# EAGLE design OpenSalinity_v02 (EAGLE 7.5.0)
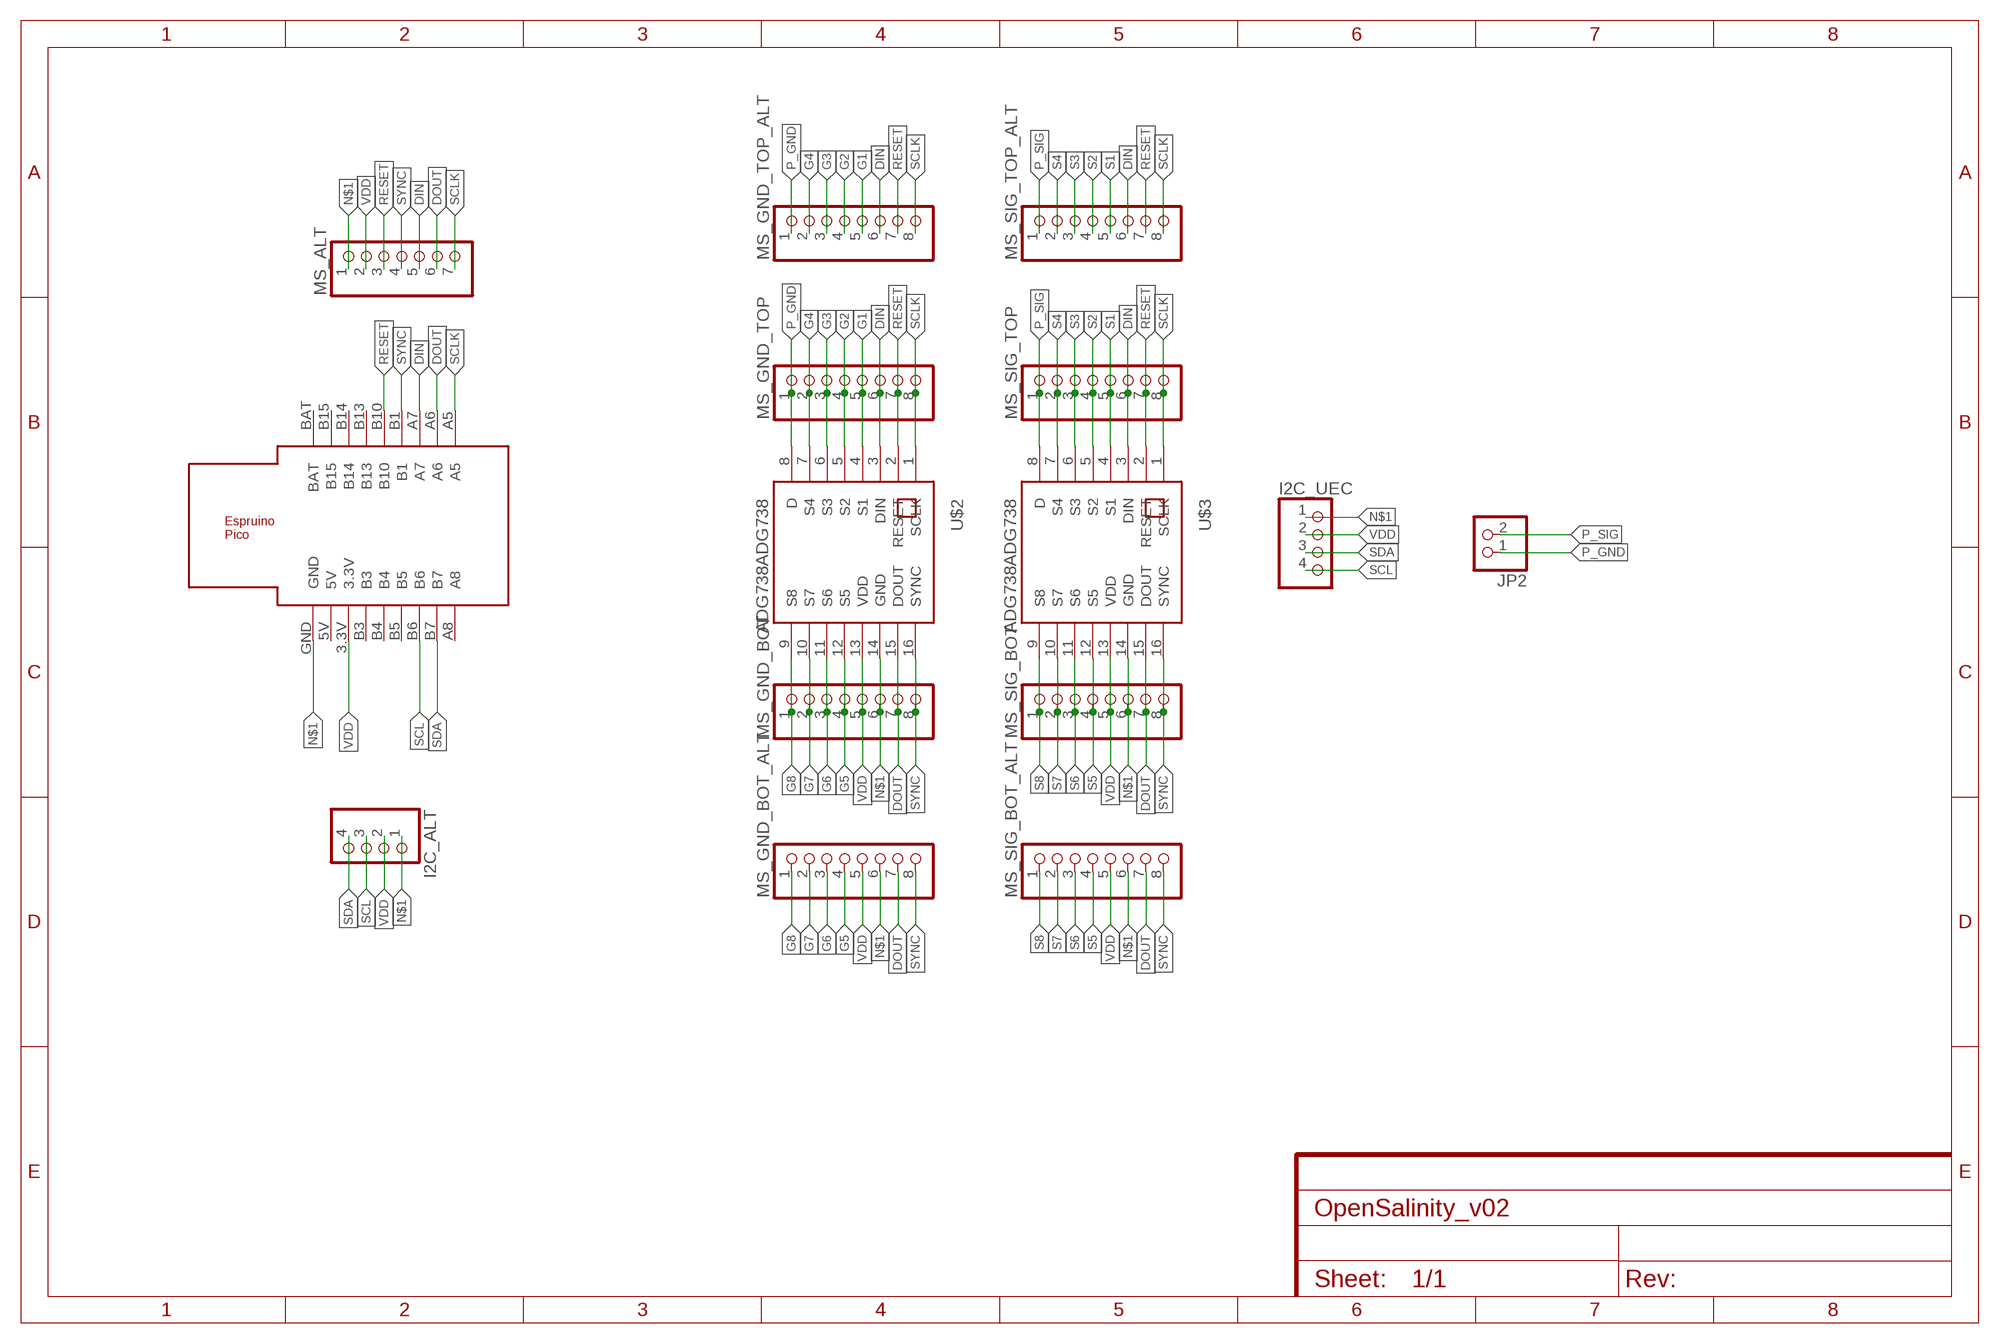
[diagram p0: schematic, sheet 1]
FRAME1 (FRAME-A4L): CNAME: CC BY SA 4.0; CREVISION: 1; DESIGNER: Sebastian Plamauer

## Parts
I2C_ALT  PINHD-1X4  [1X04]
I2C_UEC  PINHD-1X4  [1X04]
JP2  PINHD-1X2  [1X02]
MS_ALT  PINHD-1X7  [1X07]
MS_GND_BOT  PINHD-1X8  [1X08]
MS_GND_BOT_ALT  PINHD-1X8  [1X08]
MS_GND_TOP  PINHD-1X8  [1X08]
MS_GND_TOP_ALT  PINHD-1X8  [1X08]
MS_SIG_BOT  PINHD-1X8  [1X08]
MS_SIG_BOT_ALT  PINHD-1X8  [1X08]
MS_SIG_TOP  PINHD-1X8  [1X08]
MS_SIG_TOP_ALT  PINHD-1X8  [1X08]
U$1  ESPRUINO_PICO_0.1  [ESPRUINO_PICO_0.1]
U$2  ADG738ADG738  [TSSOP16]
U$3  ADG738ADG738  [TSSOP16]

## Nets
DIN: MS_ALT.5 MS_GND_TOP.6 MS_GND_TOP_ALT.6 MS_SIG_TOP.6 MS_SIG_TOP_ALT.6 U$1.A7 U$2.3(DIN) U$3.3(DIN)
DOUT: MS_ALT.6 MS_GND_BOT.7 MS_GND_BOT_ALT.7 MS_SIG_BOT.7 MS_SIG_BOT_ALT.7 U$1.A6 U$2.15(DOUT) U$3.15(DOUT)
G1: MS_GND_TOP.5 MS_GND_TOP_ALT.5 U$2.4(S1)
G2: MS_GND_TOP.4 MS_GND_TOP_ALT.4 U$2.5(S2)
G3: MS_GND_TOP.3 MS_GND_TOP_ALT.3 U$2.6(S3)
G4: MS_GND_TOP.2 MS_GND_TOP_ALT.2 U$2.7(S4)
G5: MS_GND_BOT.4 MS_GND_BOT_ALT.4 U$2.12(S5)
G6: MS_GND_BOT.3 MS_GND_BOT_ALT.3 U$2.11(S6)
G7: MS_GND_BOT.2 MS_GND_BOT_ALT.2 U$2.10(S7)
G8: MS_GND_BOT.1 MS_GND_BOT_ALT.1 U$2.9(S8)
N$1: I2C_ALT.1 I2C_UEC.1 MS_ALT.1 MS_GND_BOT.6 MS_GND_BOT_ALT.6 MS_SIG_BOT.6 MS_SIG_BOT_ALT.6 U$1.GND U$2.14(GND) U$3.14(GND)
P_GND: JP2.1 MS_GND_TOP.1 MS_GND_TOP_ALT.1 U$2.8(D)
P_SIG: JP2.2 MS_SIG_TOP.1 MS_SIG_TOP_ALT.1 U$3.8(D)
RESET: MS_ALT.3 MS_GND_TOP.7 MS_GND_TOP_ALT.7 MS_SIG_TOP.7 MS_SIG_TOP_ALT.7 U$1.B10 U$2.2(RESET) U$3.2(RESET)
S1: MS_SIG_TOP.5 MS_SIG_TOP_ALT.5 U$3.4(S1)
S2: MS_SIG_TOP.4 MS_SIG_TOP_ALT.4 U$3.5(S2)
S3: MS_SIG_TOP.3 MS_SIG_TOP_ALT.3 U$3.6(S3)
S4: MS_SIG_TOP.2 MS_SIG_TOP_ALT.2 U$3.7(S4)
S5: MS_SIG_BOT.4 MS_SIG_BOT_ALT.4 U$3.12(S5)
S6: MS_SIG_BOT.3 MS_SIG_BOT_ALT.3 U$3.11(S6)
S7: MS_SIG_BOT.2 MS_SIG_BOT_ALT.2 U$3.10(S7)
S8: MS_SIG_BOT.1 MS_SIG_BOT_ALT.1 U$3.9(S8)
SCL: I2C_ALT.3 I2C_UEC.4 U$1.B6
SCLK: MS_ALT.7 MS_GND_TOP.8 MS_GND_TOP_ALT.8 MS_SIG_TOP.8 MS_SIG_TOP_ALT.8 U$1.A5 U$2.1(SCLK) U$3.1(SCLK)
SDA: I2C_ALT.4 I2C_UEC.3 U$1.B7
SYNC: MS_ALT.4 MS_GND_BOT.8 MS_GND_BOT_ALT.8 MS_SIG_BOT.8 MS_SIG_BOT_ALT.8 U$1.B1 U$2.16(SYNC) U$3.16(SYNC)
VDD: I2C_ALT.2 I2C_UEC.2 MS_ALT.2 MS_GND_BOT.5 MS_GND_BOT_ALT.5 MS_SIG_BOT.5 MS_SIG_BOT_ALT.5 U$1.3.3V U$2.13(VDD) U$3.13(VDD)
Unconnected: U$1.5V U$1.A8 U$1.B3 U$1.B4 U$1.B5 U$1.B13 U$1.B14 U$1.B15 U$1.BAT

## Library data of the parts
I2C_ALT I2C_UEC = pinhead:PINHD-1X4: PIN HEADER
JP2 = pinhead:PINHD-1X2: PIN HEADER
MS_ALT = pinhead:PINHD-1X7: PIN HEADER
MS_GND_BOT MS_GND_BOT_ALT MS_GND_TOP MS_GND_TOP_ALT MS_SIG_BOT MS_SIG_BOT_ALT MS_SIG_TOP MS_SIG_TOP_ALT = pinhead:PINHD-1X8: PIN HEADER
U$1 = espruino_pico:ESPRUINO_PICO_0.1
U$2 U$3 = ADG738:ADG738

## Board
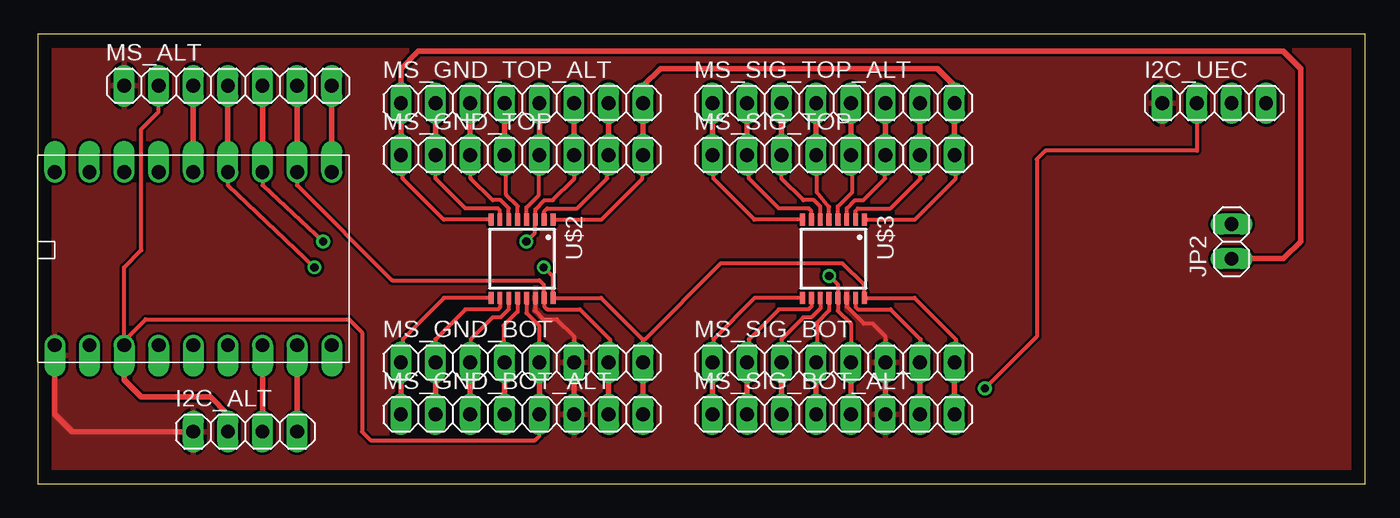
[diagram p1: board, top side]
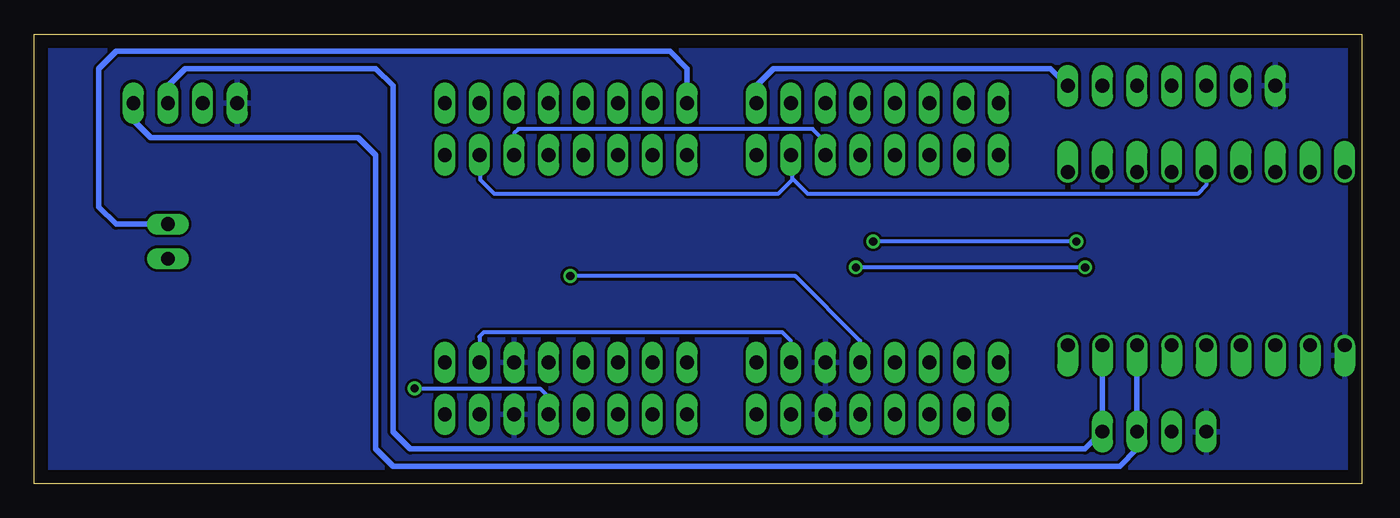
[diagram p2: board, bottom side, seen from below]

Size 97.46 x 33.01 mm. Coordinates in mm from the lower left corner, seen from the top.
Outline: 0,0 97.46,0 97.46,33.01 0,33.01 0,0
Copper layers (1*16): Top 0.035mm / dielectric 1.5mm / Bottom 0.035mm
Design rules "default": minimum track width 10mil, minimum drill 24mil, track to track 8mil, track to pad 8mil, pad to pad 8mil, via to via 8mil, smd to smd 8mil, copper to edge 40mil, drill to drill 8mil, minimum pad ring 10mil, minimum via ring 8mil, stop-mask expansion 4mil, vias tented up to drill 0mil, thermal gap 10mil

### Footprints (pad centres in the part's own frame; a part is rotated, then mirrored left to right if it is on the bottom)
1X04 = drill 1.016 long: 1 -3.81,0; 2 -1.27,0; 3 1.27,0; 4 3.81,0
1X02 = drill 1.016 long: 1 -1.27,0; 2 1.27,0
1X07 = drill 1.016 long: 1 -7.62,0; 2 -5.08,0; 3 -2.54,0; 4 0,0; 5 2.54,0; 6 5.08,0; 7 7.62,0
1X08 = drill 1.016 long: 1 -8.89,0; 2 -6.35,0; 3 -3.81,0; 4 -1.27,0; 5 1.27,0; 6 3.81,0; 7 6.35,0; 8 8.89,0
ESPRUINO_PICO_0.1 = drill 1.016 offset: 3.3V -7.62,-6.35; 5V -10.16,-6.35; A5 7.62,6.35; A6 5.08,6.35; A7 2.54,6.35; A8 7.62,-6.35; B1 0,6.35; B3 -5.08,-6.35; B4 -2.54,-6.35; B5 0,-6.35; B6 2.54,-6.35; B7 5.08,-6.35; B10 -2.54,6.35; B13 -5.08,6.35; B14 -7.62,6.35; B15 -10.16,6.35; BAT -12.7,6.35; GND -12.7,-6.35
TSSOP16 = smd 0.9 x 0.35: 1 -2.875,2.275; 2 -2.875,1.625; 3 -2.875,0.975; 4 -2.875,0.325; 5 -2.875,-0.325; 6 -2.875,-0.975; 7 -2.875,-1.625; 8 -2.875,-2.275; 9 2.875,-2.275; 10 2.875,-1.625; 11 2.875,-0.975; 12 2.875,-0.325; 13 2.875,0.325; 14 2.875,0.975; 15 2.875,1.625; 16 2.875,2.275

### Placement (x,y rotation side)
I2C_ALT  15.24,3.81 0 top
I2C_UEC  86.36,27.94 0 top
JP2  87.63,17.78 90 top
MS_ALT  13.97,29.21 0 top
MS_GND_BOT  35.56,8.89 0 top
MS_GND_BOT_ALT  35.56,5.08 0 top
MS_GND_TOP  35.56,24.13 0 top
MS_GND_TOP_ALT  35.56,27.94 0 top
MS_SIG_BOT  58.42,8.89 0 top
MS_SIG_BOT_ALT  58.42,5.08 0 top
MS_SIG_TOP  58.42,24.13 0 top
MS_SIG_TOP_ALT  58.42,27.94 0 top
U$1  13.97,16.51 0 top
U$2  35.56,16.51 270 top
U$3  58.42,16.51 270 top

### Tracks (layer width: path | path; a pad name or v marks a point on that pad's centre or on a via)
DIN  (via drill 0.6)
  Top 0.305: MS_GND_TOP.6 39.4,24.1 39.4,22.4 37.8,20.8 37.2,20.8 36.53,20.14 U$2.3 36.51,19.36 36.51,18.41 v35.88,17.78 | U$3.3 59.4,20.2 60,20.8 60.6,20.8 62.2,22.4 62.2,24.1 MS_SIG_TOP.6 | U$1.A7 16.51,21.91 v20.95,17.78
  Top 0.406: MS_ALT.5 U$1.A7 | MS_GND_TOP.6 MS_GND_TOP_ALT.6 | MS_SIG_TOP.6 MS_SIG_TOP_ALT.6
  Bottom 0.305: v20.95,17.78 v35.88,17.78 | MS_GND_TOP.6 39.37,25.08 40.32,26.04 61.91,26.04 62.23,25.72 MS_SIG_TOP.6
DOUT
  Top 0.305: MS_GND_BOT.7 42,8.98 42,10.6 39.8,12.8 37.4,12.8 37.19,13.02 U$2.15 37.15,13.67 37.15,14.61 36.83,14.92 26.04,14.92 19.05,21.91 U$1.A6 | U$3.15 60.05,12.96 60.2,12.8 62.6,12.8 64.8,10.6 64.8,8.92 MS_SIG_BOT.7
  Top 0.406: MS_ALT.6 U$1.A6 | MS_GND_BOT_ALT.7 MS_GND_BOT.7 | MS_SIG_BOT_ALT.7 MS_SIG_BOT.7
  Bottom 0.305: MS_GND_BOT.7 41.91,10.48 42.55,11.11 64.45,11.11 64.77,10.79 MS_SIG_BOT.7
G1
  Top 0.305: U$2.4 35.88,20.29 36.8,21.2 36.8,24.1 MS_GND_TOP.5
  Top 0.406: MS_GND_TOP.5 MS_GND_TOP_ALT.5
G2
  Top 0.305: U$2.5 35.23,20.36 34.4,21.2 34.4,24.02 MS_GND_TOP.4
  Top 0.406: MS_GND_TOP.4 MS_GND_TOP_ALT.4
G3
  Top 0.305: U$2.6 34.59,20.21 34,20.8 33.4,20.8 31.8,22.4 31.8,24.08 MS_GND_TOP.3
  Top 0.406: MS_GND_TOP.3 MS_GND_TOP_ALT.3
G4
  Top 0.305: U$2.7 33.94,20.07 33.8,20.2 31.4,20.2 29.2,22.4 MS_GND_TOP.2
  Top 0.406: MS_GND_TOP.2 MS_GND_TOP_ALT.2
G5
  Top 0.305: U$2.12 35.23,12.63 34.2,11.6 34.2,8.98 MS_GND_BOT.4
  Top 0.406: MS_GND_BOT.4 MS_GND_BOT_ALT.4
G6
  Top 0.305: U$2.11 34.59,12.79 34,12.2 33.4,12.2 31.8,10.6 31.8,8.94 MS_GND_BOT.3
  Top 0.406: MS_GND_BOT_ALT.3 MS_GND_BOT.3
G7
  Top 0.305: U$2.10 33.94,12.94 33.8,12.8 31.4,12.8 29.2,10.6 MS_GND_BOT.2
  Top 0.406: MS_GND_BOT_ALT.2 MS_GND_BOT.2
G8
  Top 0.305: U$2.9 29.84,13.63 26.8,10.6 26.8,9.02 MS_GND_BOT.1
  Top 0.406: MS_GND_BOT_ALT.1 MS_GND_BOT.1
N$1
  Top 0.305: 36.51,13.65 36.51,12.7 37.15,12.06 38.1,12.06 39.37,10.79 MS_GND_BOT.6 | U$3.14 59.4,12.99 60.64,11.75 61.28,11.75 62.23,10.79 MS_SIG_BOT.6
  Top 0.406: I2C_ALT.1 2.54,3.81 1.27,5.08 U$1.GND | MS_GND_BOT_ALT.6 MS_GND_BOT.6 | MS_SIG_BOT_ALT.6 MS_SIG_BOT.6
  pour Top: 0,0 0,33.02 99.06,33.02 99.06,0
  pour Bottom: 0,0 0,33.02 97.79,33.02 97.79,0
P_GND
  Top 0.305: U$2.8 29.82,19.39 26.8,22.4 26.8,24 MS_GND_TOP.1
  Top 0.406: MS_GND_TOP.1 MS_GND_TOP_ALT.1 26.67,30.48 27.94,31.75 91.44,31.75 92.71,30.48 92.71,17.78 91.44,16.51 JP2.1
P_SIG
  Top 0.305: U$3.8 52.62,19.39 49.6,22.4 49.6,24.06 MS_SIG_TOP.1
  Top 0.406: MS_SIG_TOP.1 MS_SIG_TOP_ALT.1
  Bottom 0.406: JP2.2 91.44,19.05 92.71,20.32 92.71,30.48 91.44,31.75 50.8,31.75 49.53,30.48 MS_SIG_TOP_ALT.1
RESET
  Top 0.305: U$2.2 37.19,19.98 37.4,20.2 39.6,20.2 41.8,22.4 41.8,24.02 MS_GND_TOP.7 | U$3.2 60.05,20.05 60.2,20.2 62.6,20.2 64.8,22.4 64.8,24.1 MS_SIG_TOP.7
  Top 0.406: MS_ALT.3 U$1.B10 | MS_GND_TOP.7 MS_GND_TOP_ALT.7 | MS_SIG_TOP.7 MS_SIG_TOP_ALT.7
  Bottom 0.305: U$1.B10 11.43,21.91 12.06,21.27 40.67,21.27 41.8,22.4 | 41.8,22.4 41.8,24.02 MS_GND_TOP.7 | 41.8,22.4 41.8,22.34 42.86,21.27 63.67,21.27 64.7,22.3 64.7,24.06 MS_SIG_TOP.7
S1
  Top 0.305: U$3.4 58.74,20.34 59.8,21.4 59.8,24.02 MS_SIG_TOP.5
  Top 0.406: MS_SIG_TOP.5 MS_SIG_TOP_ALT.5
S2
  Top 0.305: U$3.5 58.09,20.3 57.2,21.4 57.2,24.08 MS_SIG_TOP.4
  Top 0.406: MS_SIG_TOP.4 MS_SIG_TOP_ALT.4
S3
  Top 0.305: U$3.6 57.45,20.36 57,20.8 56.2,20.8 54.6,22.4 MS_SIG_TOP.3
  Top 0.406: MS_SIG_TOP.3 MS_SIG_TOP_ALT.3
S4
  Top 0.305: U$3.7 56.8,20 56.6,20.2 54.4,20.2 52.2,22.4 52.2,24 MS_SIG_TOP.2
  Top 0.406: MS_SIG_TOP.2 MS_SIG_TOP_ALT.2
S5
  Top 0.305: U$3.12 58.09,12.7 57.2,11.8 57.2,8.94 MS_SIG_BOT.4
  Top 0.406: MS_SIG_BOT_ALT.4 MS_SIG_BOT.4
S6
  Top 0.305: U$3.11 57.45,12.85 56.8,12.2 56.2,12.2 54.6,10.6 MS_SIG_BOT.3
  Top 0.406: MS_SIG_BOT_ALT.3 MS_SIG_BOT.3
S7
  Top 0.305: U$3.10 56.8,12.99 56.6,12.8 54.4,12.8 52.2,10.6 52.2,9.02 MS_SIG_BOT.2
  Top 0.406: MS_SIG_BOT_ALT.2 MS_SIG_BOT.2
S8
  Top 0.305: U$3.9 52.63,13.63 49.6,10.6 49.6,8.96 MS_SIG_BOT.1
  Top 0.406: MS_SIG_BOT_ALT.1 MS_SIG_BOT.1
SCL
  Top 0.406: I2C_ALT.3 U$1.B6
  Bottom 0.406: I2C_UEC.4 90.17,26.67 88.9,25.4 73.66,25.4 72.39,24.13 72.39,2.54 71.12,1.27 17.78,1.27 16.51,2.54 U$1.B6
SCLK
  Top 0.305: U$2.1 41.38,19.39 44.4,22.4 44.4,24.08 MS_GND_TOP.8 | U$3.1 64.39,19.39 67.4,22.4 67.4,24.04 MS_SIG_TOP.8
  Top 0.406: MS_ALT.7 U$1.A5 | MS_GND_TOP.8 MS_GND_TOP_ALT.8 44.45,29.21 45.72,30.48 66.04,30.48 67.31,29.21 MS_SIG_TOP_ALT.8 MS_SIG_TOP.8
  Bottom 0.406: MS_ALT.7 22.86,30.48 43.18,30.48 44.45,29.21 MS_GND_TOP_ALT.8
SDA
  Top 0.406: I2C_ALT.4 U$1.B7
  Bottom 0.406: U$1.B7 I2C_ALT.4 20.32,2.54 69.85,2.54 71.12,3.81 71.12,29.21 72.39,30.48 86.36,30.48 87.63,29.21 I2C_UEC.3
SYNC  (via drill 0.6)
  Top 0.305: 44.4,10.6 41.37,13.63 U$2.16 37.78,13.69 37.78,15.24 v37.15,15.88 | 44.4,10.6 44.4,8.94 MS_GND_BOT.8 | MS_SIG_BOT.8 67.4,8.98 67.4,10.6 64.36,13.63 U$3.16 60.64,13.69 60.64,14.61 59.05,16.19 50.16,16.19 44.57,10.6 44.4,10.6 | U$1.B1 13.97,21.91 v20.32,15.88
  Top 0.406: MS_ALT.4 U$1.B1 | MS_GND_BOT_ALT.8 MS_GND_BOT.8 | MS_SIG_BOT_ALT.8 MS_SIG_BOT.8
  Bottom 0.305: v20.32,15.88 v37.15,15.88
VDD  (via drill 0.6)
  Top 0.305: U$2.13 35.88,12.52 36.8,11.6 36.8,8.92 MS_GND_BOT.5 | I2C_UEC.2 85.09,24.45 73.98,24.45 73.34,23.81 73.34,10.79 v69.53,6.99 | MS_SIG_BOT.5 59.69,11.75 58.74,12.69 U$3.13 58.74,13.64 58.74,14.61 v58.1,15.24 | MS_ALT.2 8.89,27.3 7.62,26.04 7.62,17.14 6.35,15.88 U$1.3.3V 6.35,10.48 7.94,12.06 22.86,12.06 23.81,11.11 23.81,3.81 24.45,3.17 36.51,3.17 36.83,3.49 MS_GND_BOT_ALT.5
  Top 0.406: U$1.3.3V 6.35,7.62 7.62,6.35 12.7,6.35 13.97,5.08 I2C_ALT.2 | MS_GND_BOT_ALT.5 MS_GND_BOT.5 | MS_SIG_BOT_ALT.5 MS_SIG_BOT.5
  Bottom 0.305: v69.53,6.99 60.33,6.99 59.69,6.35 MS_SIG_BOT_ALT.5 | MS_GND_BOT.5 36.83,10.48 41.59,15.24 v58.1,15.24